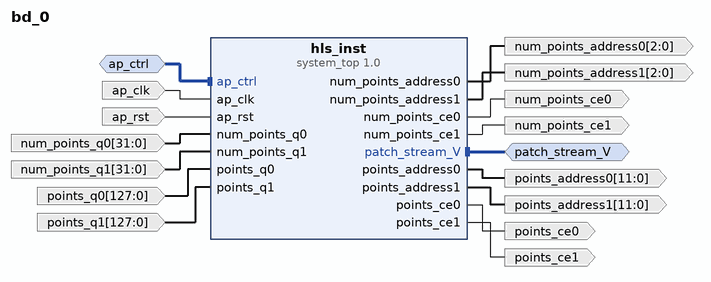
[diagram p0: block diagram of the top level]
# Vivado block design bd_0, xc7z030sbg485-3, Vivado 2020.2
create_bd_design bd_0

create_bd_intf_port -mode Slave -vlnv xilinx.com:interface:acc_handshake_rtl:1.0 ap_ctrl
create_bd_intf_port -mode Master -vlnv xilinx.com:interface:acc_fifo_write_rtl:1.0 patch_stream_V
create_bd_port -dir I -type clk ap_clk
set_property -dict {CONFIG.FREQ_HZ 100000000.0} [get_bd_ports ap_clk]
create_bd_port -dir I -type rst ap_rst
set_property -dict {CONFIG.POLARITY ACTIVE_HIGH} [get_bd_ports ap_rst]
create_bd_port -dir O -from 2 -to 0 -type data num_points_address0
create_bd_port -dir O -from 2 -to 0 -type data num_points_address1
create_bd_port -dir O num_points_ce0
create_bd_port -dir O num_points_ce1
create_bd_port -dir I -from 31 -to 0 -type data num_points_q0
create_bd_port -dir I -from 31 -to 0 -type data num_points_q1
create_bd_port -dir O -from 11 -to 0 -type data points_address0
create_bd_port -dir O -from 11 -to 0 -type data points_address1
create_bd_port -dir O points_ce0
create_bd_port -dir O points_ce1
create_bd_port -dir I -from 127 -to 0 -type data points_q0
create_bd_port -dir I -from 127 -to 0 -type data points_q1

create_bd_cell -type ip -vlnv xilinx.com:hls:system_top:1.0 hls_inst

# ---- connections ----

connect_bd_intf_net [get_bd_intf_ports patch_stream_V] [get_bd_intf_pins hls_inst/patch_stream_V]
connect_bd_intf_net -intf_net ap_ctrl_0_1 [get_bd_intf_ports ap_ctrl] [get_bd_intf_pins hls_inst/ap_ctrl]
connect_bd_net -net ap_clk_0_1 [get_bd_ports ap_clk] [get_bd_pins hls_inst/ap_clk]
connect_bd_net -net ap_rst_0_1 [get_bd_ports ap_rst] [get_bd_pins hls_inst/ap_rst]
connect_bd_net [get_bd_pins hls_inst/num_points_address0] [get_bd_ports num_points_address0]
connect_bd_net [get_bd_pins hls_inst/num_points_address1] [get_bd_ports num_points_address1]
connect_bd_net [get_bd_pins hls_inst/num_points_ce0] [get_bd_ports num_points_ce0]
connect_bd_net [get_bd_pins hls_inst/num_points_ce1] [get_bd_ports num_points_ce1]
connect_bd_net -net num_points_q0_0_1 [get_bd_ports num_points_q0] [get_bd_pins hls_inst/num_points_q0]
connect_bd_net -net num_points_q1_0_1 [get_bd_ports num_points_q1] [get_bd_pins hls_inst/num_points_q1]
connect_bd_net [get_bd_pins hls_inst/points_address0] [get_bd_ports points_address0]
connect_bd_net [get_bd_pins hls_inst/points_address1] [get_bd_ports points_address1]
connect_bd_net [get_bd_pins hls_inst/points_ce0] [get_bd_ports points_ce0]
connect_bd_net [get_bd_pins hls_inst/points_ce1] [get_bd_ports points_ce1]
connect_bd_net -net points_q0_0_1 [get_bd_ports points_q0] [get_bd_pins hls_inst/points_q0]
connect_bd_net -net points_q1_0_1 [get_bd_ports points_q1] [get_bd_pins hls_inst/points_q1]

validate_bd_design
save_bd_design
